# EAGLE design PCB (EAGLE 9.6.2)
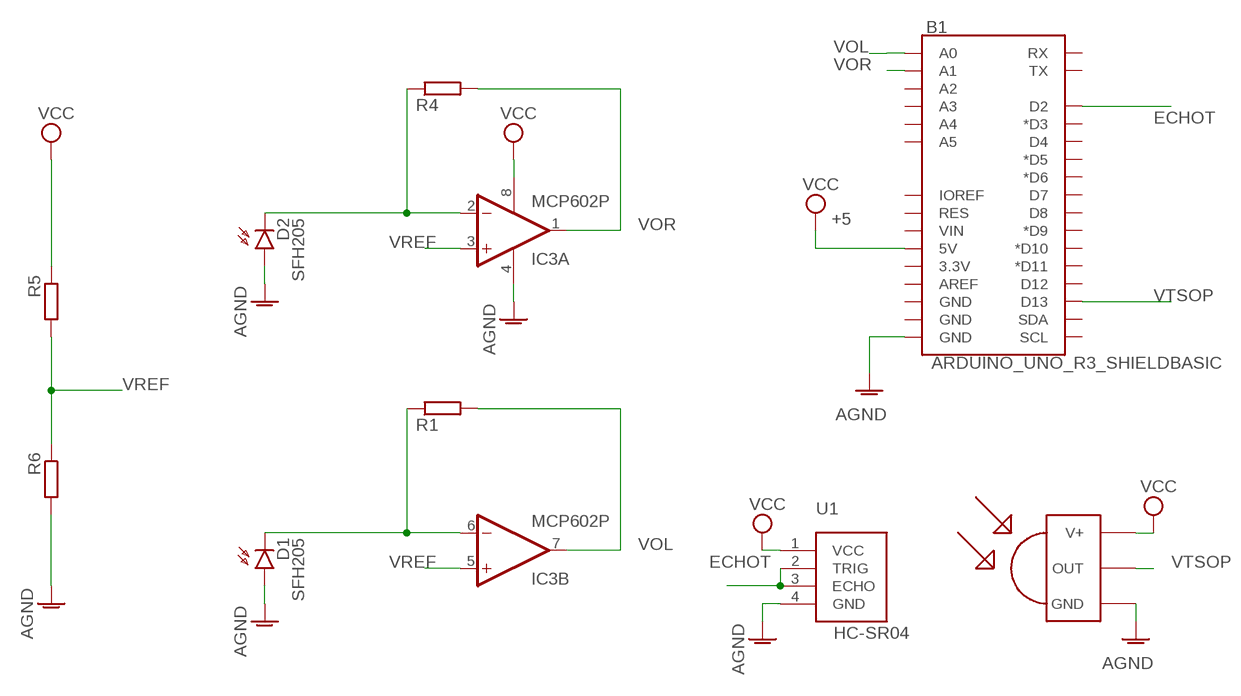
[diagram p0: schematic, sheet 1]

## Parts
B1  ARDUINO_UNO_R3_SHIELDBASIC  [UNO_R3_SHIELD]
D1  SFH205  [SFH205]
D2  SFH205  [SFH205]
IC3  MCP602P  [DIL08]
R1  R-EU_0207/10  [0207/10]
R4  R-EU_0207/10  [0207/10]
R5  R-EU_0207/10  [0207/10]
R6  R-EU_0207/10  [0207/10]
U1  HC-SR04  [XCVR_HC-SR04]
U$3  TSOP4856  [TSOP18XX]

## Nets
AGND: B1.GND@0(GND) D1.A D2.A IC3.4(P:V-) R6.2 U1.4(GND) U$3.GND
ECHOT: B1.D2 U1.2(TRIG) U1.3(ECHO)
N$1: D2.K(C) IC3.2(A:-IN) R4.1
N$2: D1.K(C) IC3.6(B:-IN) R1.1
VCC: B1.5V IC3.8(P:V+) R5.1 U1.1(VCC) U$3.VCC(V+)
VOL: B1.A0 IC3.7(B:OUT) R1.2
VOR: B1.A1 IC3.1(A:OUT) R4.2
VREF: IC3.3(A:+IN) IC3.5(B:+IN) R5.2 R6.1
VTSOP: B1.D13 U$3.OUT
Unconnected: B1.3.3V B1.A2 B1.A3 B1.A4 B1.A5 B1.AREF B1.D3(*D3) B1.D4 B1.D5(*D5) B1.D6(*D6) B1.D7 B1.D8 B1.D9(*D9) B1.D10(*D10) B1.D11(*D11) B1.D12 B1.GND@1(GND) B1.GND@2(GND) B1.IOREF B1.RES B1.RX B1.SCL B1.SDA B1.TX B1.VIN

## Library data of the parts
B1 = SparkFun-Boards:ARDUINO_UNO_R3_SHIELD: Arduino R3 Shield Footprint Shield form compatible with the Arduino Uno R3. SparkFun Products: MG2639 Cellular Shield <https://www.sparkfun.com/products/13120> MIDI Shield <https://www.sparkfun.com/products/12898> R3 Stackable Headers Kit <https://www.sparkfun.com/products/11417>
D1 D2 = opto-trans-siemens:SFH205: PHOTO DIODE; OC_FARNELL: unknown; OC_NEWARK: unknown
IC3 = linear:MCP602: Single Op Amp 2.7V to 6.0V Single Supply CMOS Source: http://ww1.microchip.com/downloads/en/DeviceDoc/21314g.pdf
R1 R4-R6 = rcl:R-EU_: RESISTOR, European symbol; SPICEPREFIX: R
U1 = HC-SR04:HC-SR04: Ultrasonic Sensor Module Check availability <https://pricing.snapeda.com/parts/HC-SR04/SparkFun%20Electronics/view-part?ref=eda>; AVAILABILITY: Not in stock; DESCRIPTION: HC-SR04 Ultrasonic Sensor Qwiic Platform Evaluation Expansion Board; MF: SparkFun Electronics; MP: HC-SR04; PACKAGE: None; PRICE: None
U$3 = tsop (1):TSOP4856: IR Receiver and Demodulator

## Board
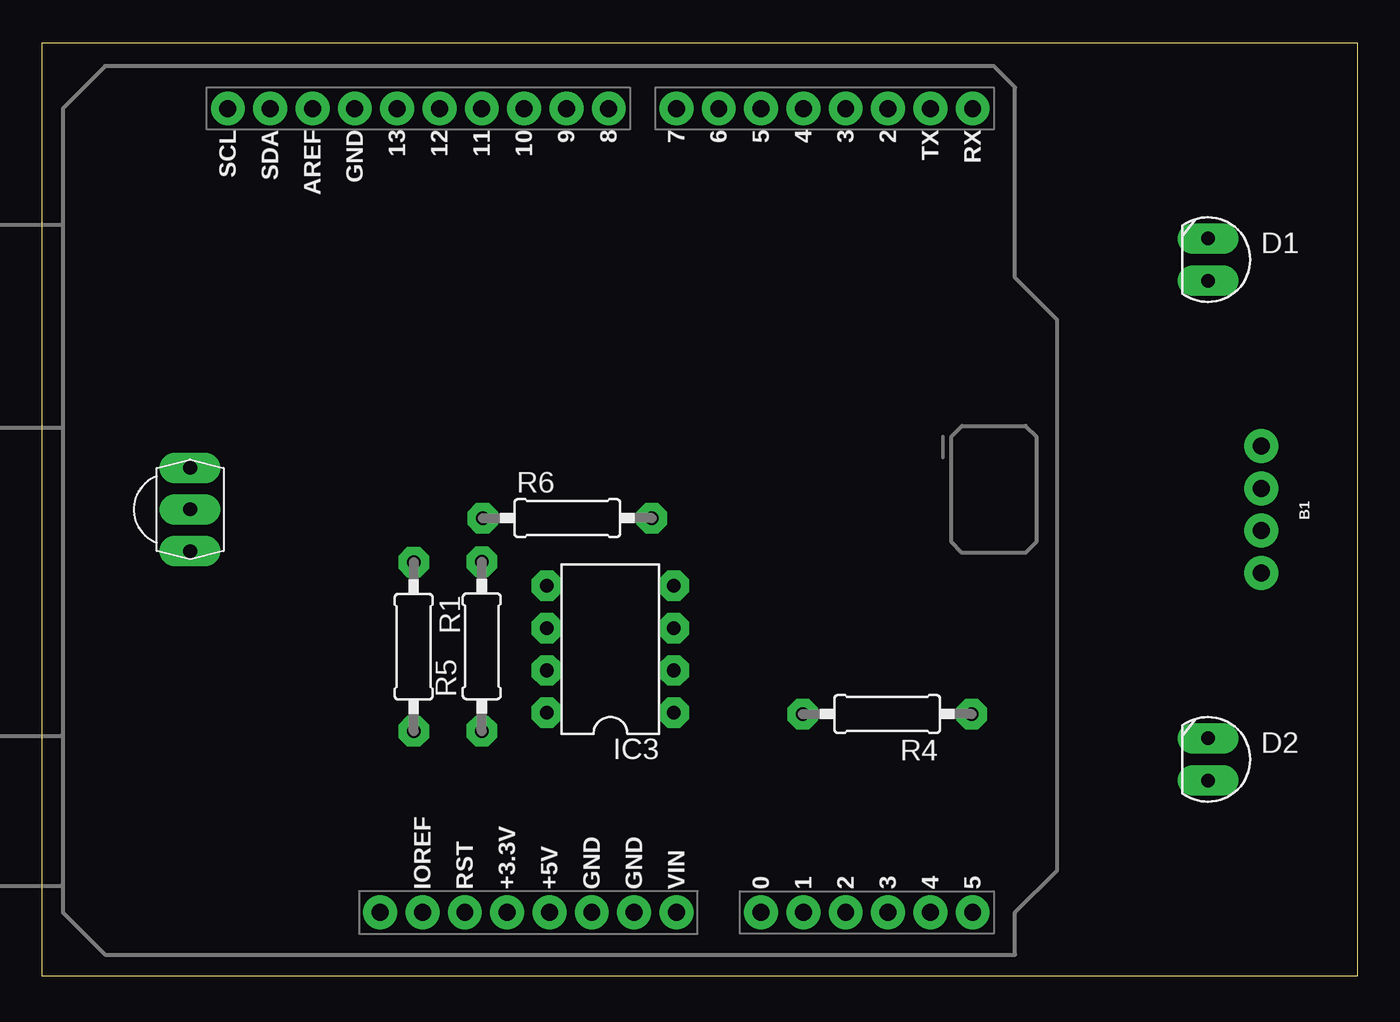
[diagram p1: board, top side]
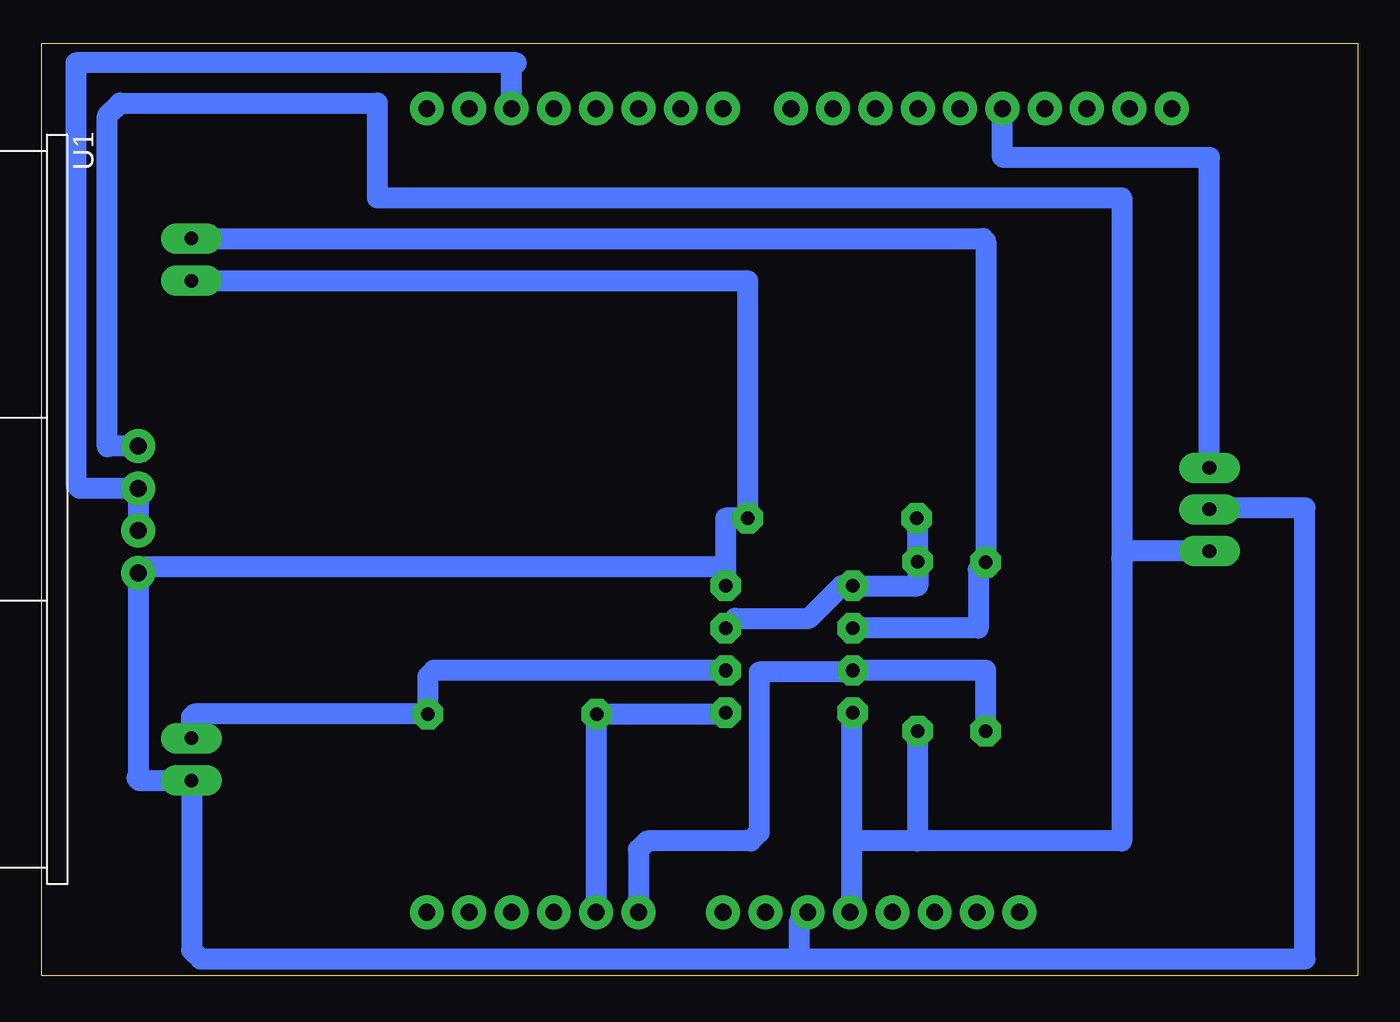
[diagram p2: board, bottom side, seen from below]

Size 79 x 56 mm. Coordinates in mm from the lower left corner, seen from the top.
Outline: 0,0 79,0 79,56 0,56 0,0
Copper layers (1*16): Top 0.035mm / dielectric 1.5mm / Bottom 0.035mm
Design rules "LabE": minimum track width 50mil, minimum drill 0.8mm, track to track 16mil, track to pad 16mil, pad to pad 16mil, via to via 16mil, smd to smd 16mil, copper to edge 0mil, drill to drill 16mil, minimum pad ring 20mil, minimum via ring 20mil, stop-mask expansion 4mil, vias tented up to drill 0mil, thermal gap 10mil

### Footprints (pad centres in the part's own frame; a part is rotated, then mirrored left to right if it is on the bottom)
UNO_R3_SHIELD = drill 1.016 pad 1.88: 3.3V 24.13,-2.54; 5V 24.13,0; A0 24.13,12.7; A1 24.13,15.24; A2 24.13,17.78; A3 24.13,20.32; A4 24.13,22.86; A5 24.13,25.4; AREF -24.13,-14.224; D2 -24.13,20.32; D3 -24.13,17.78; D4 -24.13,15.24; D5 -24.13,12.7; D6 -24.13,10.16; D7 -24.13,7.62; D8 -24.13,3.556; D9 -24.13,1.016; D10 -24.13,-1.524; D11 -24.13,-4.064; D12 -24.13,-6.604; D13 -24.13,-9.144; GND@0 24.13,2.54; GND@1 24.13,5.08; GND@2 -24.13,-11.684; IOREF 24.13,-7.62; NC 24.13,-10.16; RES 24.13,-5.08; RX -24.13,25.4; SCL -24.13,-19.304; SDA -24.13,-16.764; TX -24.13,22.86; VIN 24.13,7.62
SFH205 = drill 0.813 long: A 0,-1.27; K 0,1.27
DIL08 = drill 0.813 pad 1.778 octagon: 1 -3.81,-3.81; 2 -1.27,-3.81; 3 1.27,-3.81; 4 3.81,-3.81; 5 3.81,3.81; 6 1.27,3.81; 7 -1.27,3.81; 8 -3.81,3.81
0207/10 = drill 0.813 octagon: 1 -5.08,0; 2 5.08,0
XCVR_HC-SR04 = drill 1.02: 1 -3.81,0; 2 -1.27,0; 3 1.27,0; 4 3.81,0
TSOP18XX = drill 0.813 long: GND -0.001,-0.027; OUT -2.501,-0.027; VCC 2.499,-0.027

### Placement (x,y rotation side)
B1  30.48,27.94 270 top
D1  70,43 0 top
D2  70,13 0 top
IC3  34.14,19.61 90 top
R1  22.33,19.76 270 top
R4  50.75,15.72 180 top
R5  26.42,19.79 90 top
R6  31.55,27.48 0 top
U1  73.2,28 270 bottom
U$3  8.94,28 270 top

### Tracks (layer width: path | path; a pad name or v marks a point on that pad's centre or on a via)
AGND
  Bottom 1.27: B1.GND@0 33.5,3.33 33.5,1.31 33.79,1.02 | 33.79,1.02 69.47,1.02 70,1.55 D2.A 73.12,11.73 73.28,11.89 73.2,11.97 U1.4 72.85,24.54 37.95,24.54 | 33.79,1.02 3.17,1.02 3.17,28.09 8.82,28.09 U$3.GND | 37.95,24.54 37.95,27.48 R6.2 36.63,41.73 D1.A | 37.95,24.54 IC3.4
ECHOT
  Bottom 1.27: U1.3 U1.2 76.72,29.27 76.94,29.49 76.94,54.81 50.49,54.81 50.8,54.51 B1.D2
N$1
  Bottom 1.27: IC3.2 55.45,18.34 55.83,17.96 R4.1 69.83,15.72 69.98,15.57 70,15.55 D2.K
N$2
  Bottom 1.27: IC3.6 22.78,20.88 22.78,24.38 R1.1 22.33,44.09 22.5,44.27 D1.K
VCC
  Bottom 1.27: 26.44,8.1 14.17,8.1 14.17,25.07 | 26.44,8.1 30.38,8.1 | R5.1 26.44,14.68 26.44,8.1 | 30.38,8.1 30.38,15.75 IC3.8 | B1.5V 30.38,3.91 30.38,8.1 | 14.17,25.07 14.17,46.71 58.85,46.71 58.85,52.4 74.3,52.4 75.06,51.64 75.06,31.75 75,31.81 U1.1 | U$3.VCC 13.74,25.5 14.17,25.07
VOL
  Bottom 1.27: R1.2 22.33,18.34 IC3.7 30.43,18.24 35.94,18.24 35.94,8.61 36.45,8.1 42.65,8.1 43.18,7.57 B1.A0
VOR
  Bottom 1.27: B1.A1 45.72,15.67 R4.2 38.02,15.72 IC3.1
VREF
  Bottom 1.27: IC3.3 37.36,21.46 32.95,21.46 30.99,23.42 IC3.5 26.42,23.42 R5.2 26.42,27.43 R6.1
VTSOP
  Bottom 1.27: U$3.OUT 8.91,49.12 21.26,49.12 21.34,49.2 B1.D13